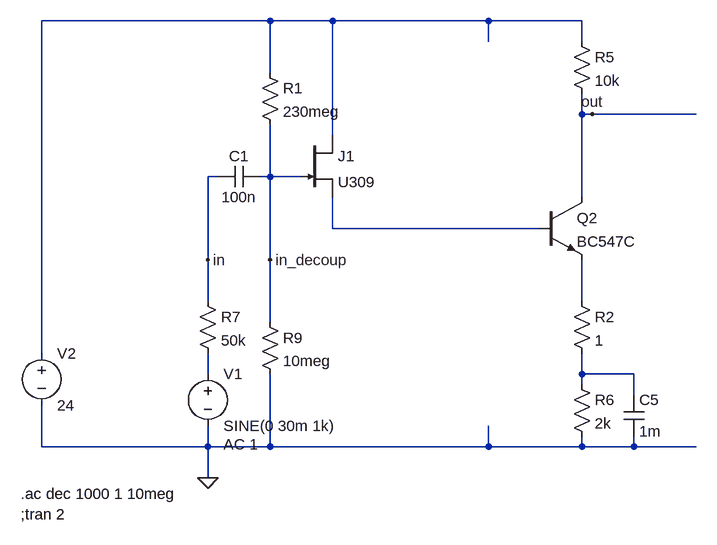
[diagram p0: schematic amp_labor2_2trans_3.asc]
amp_labor2_2trans_3.asc, the LTspice schematic file:
Version 4
SHEET 1 880 936
WIRE -144 160 -496 160
WIRE -48 160 -144 160
WIRE 192 160 -48 160
WIRE 336 160 192 160
WIRE 192 192 192 160
WIRE 336 192 336 160
WIRE -144 240 -144 160
WIRE 336 304 336 272
WIRE 352 304 336 304
WIRE 432 304 352 304
WIRE 512 304 432 304
WIRE -48 336 -48 160
WIRE -224 400 -240 400
WIRE -144 400 -144 320
WIRE -144 400 -160 400
WIRE -96 400 -144 400
WIRE 336 432 336 304
WIRE -48 480 -48 432
WIRE 192 480 -48 480
WIRE 272 480 192 480
WIRE -240 528 -240 400
WIRE -144 528 -144 400
WIRE 336 544 336 528
WIRE -240 592 -240 528
WIRE 336 592 336 544
WIRE -144 624 -144 528
WIRE -496 672 -496 160
WIRE -240 704 -240 672
WIRE 336 704 336 672
WIRE 416 704 336 704
WIRE 336 720 336 704
WIRE 416 736 416 704
WIRE -496 816 -496 752
WIRE -240 816 -240 784
WIRE -240 816 -496 816
WIRE -144 816 -144 704
WIRE -144 816 -240 816
WIRE 192 816 192 784
WIRE 192 816 -144 816
WIRE 336 816 336 800
WIRE 336 816 192 816
WIRE 416 816 416 800
WIRE 416 816 336 816
WIRE 512 816 416 816
WIRE -240 864 -240 816
FLAG -240 864 0
FLAG 352 304 out
FLAG -240 528 in
FLAG -144 528 in_decoup
DATAFLAG 432 304 ""
DATAFLAG 336 544 ""
DATAFLAG 192 480 ""
DATAFLAG -144 160 ""
SYMBOL npn 272 432 R0
SYMATTR InstName Q2
SYMATTR Value BC547C
SYMBOL res 320 176 R0
SYMATTR InstName R5
SYMATTR Value 10k
SYMBOL res 320 704 R0
SYMATTR InstName R6
SYMATTR Value 2k
SYMBOL cap -160 384 R90
WINDOW 0 0 32 VBottom 2
WINDOW 3 32 32 VTop 2
SYMATTR InstName C1
SYMATTR Value 100n
SYMBOL voltage -240 688 R0
WINDOW 123 24 124 Left 2
WINDOW 39 0 0 Left 2
SYMATTR Value2 AC 1
SYMATTR InstName V1
SYMATTR Value SINE(0 30m 1k)
SYMBOL voltage -496 656 R0
WINDOW 123 0 0 Left 2
WINDOW 39 0 0 Left 2
SYMATTR InstName V2
SYMATTR Value 24
SYMBOL res -256 576 R0
SYMATTR InstName R7
SYMATTR Value 50k
SYMBOL njf -96 336 R0
SYMATTR InstName J1
SYMATTR Value U309
SYMBOL res -160 608 R0
SYMATTR InstName R9
SYMATTR Value 10meg
SYMBOL cap 400 736 R0
SYMATTR InstName C5
SYMATTR Value 1m
SYMBOL res -160 224 R0
SYMATTR InstName R1
SYMATTR Value 230meg
SYMBOL res 320 576 R0
SYMATTR InstName R2
SYMATTR Value 1
TEXT -528 888 Left 2 !.ac dec 1000 1 10meg
TEXT -528 920 Left 2 !;tran 2

The netlist it stands for:
* amp_labor2_2trans_3.asc
Q2 out N002 N003 0 BC547C
R5 N001 out 10k
R6 N005 0 2k
C1 in_decoup in 100n
V1 N004 0 SINE(0 30m 1k) AC 1
V2 N001 0 24
R7 in N004 50k
J1 N001 in_decoup N002 U309
R9 in_decoup 0 10meg
C5 N005 0 1m
R1 N001 in_decoup 230meg
R2 N003 N005 1
.model NPN NPN
.model PNP PNP
.lib standard.bjt
.model NJF NJF
.model PJF PJF
.lib standard.jft
.ac dec 1000 1 10meg
;tran 2
.backanno
.end